# Altium project Power_driver.PrjPCB
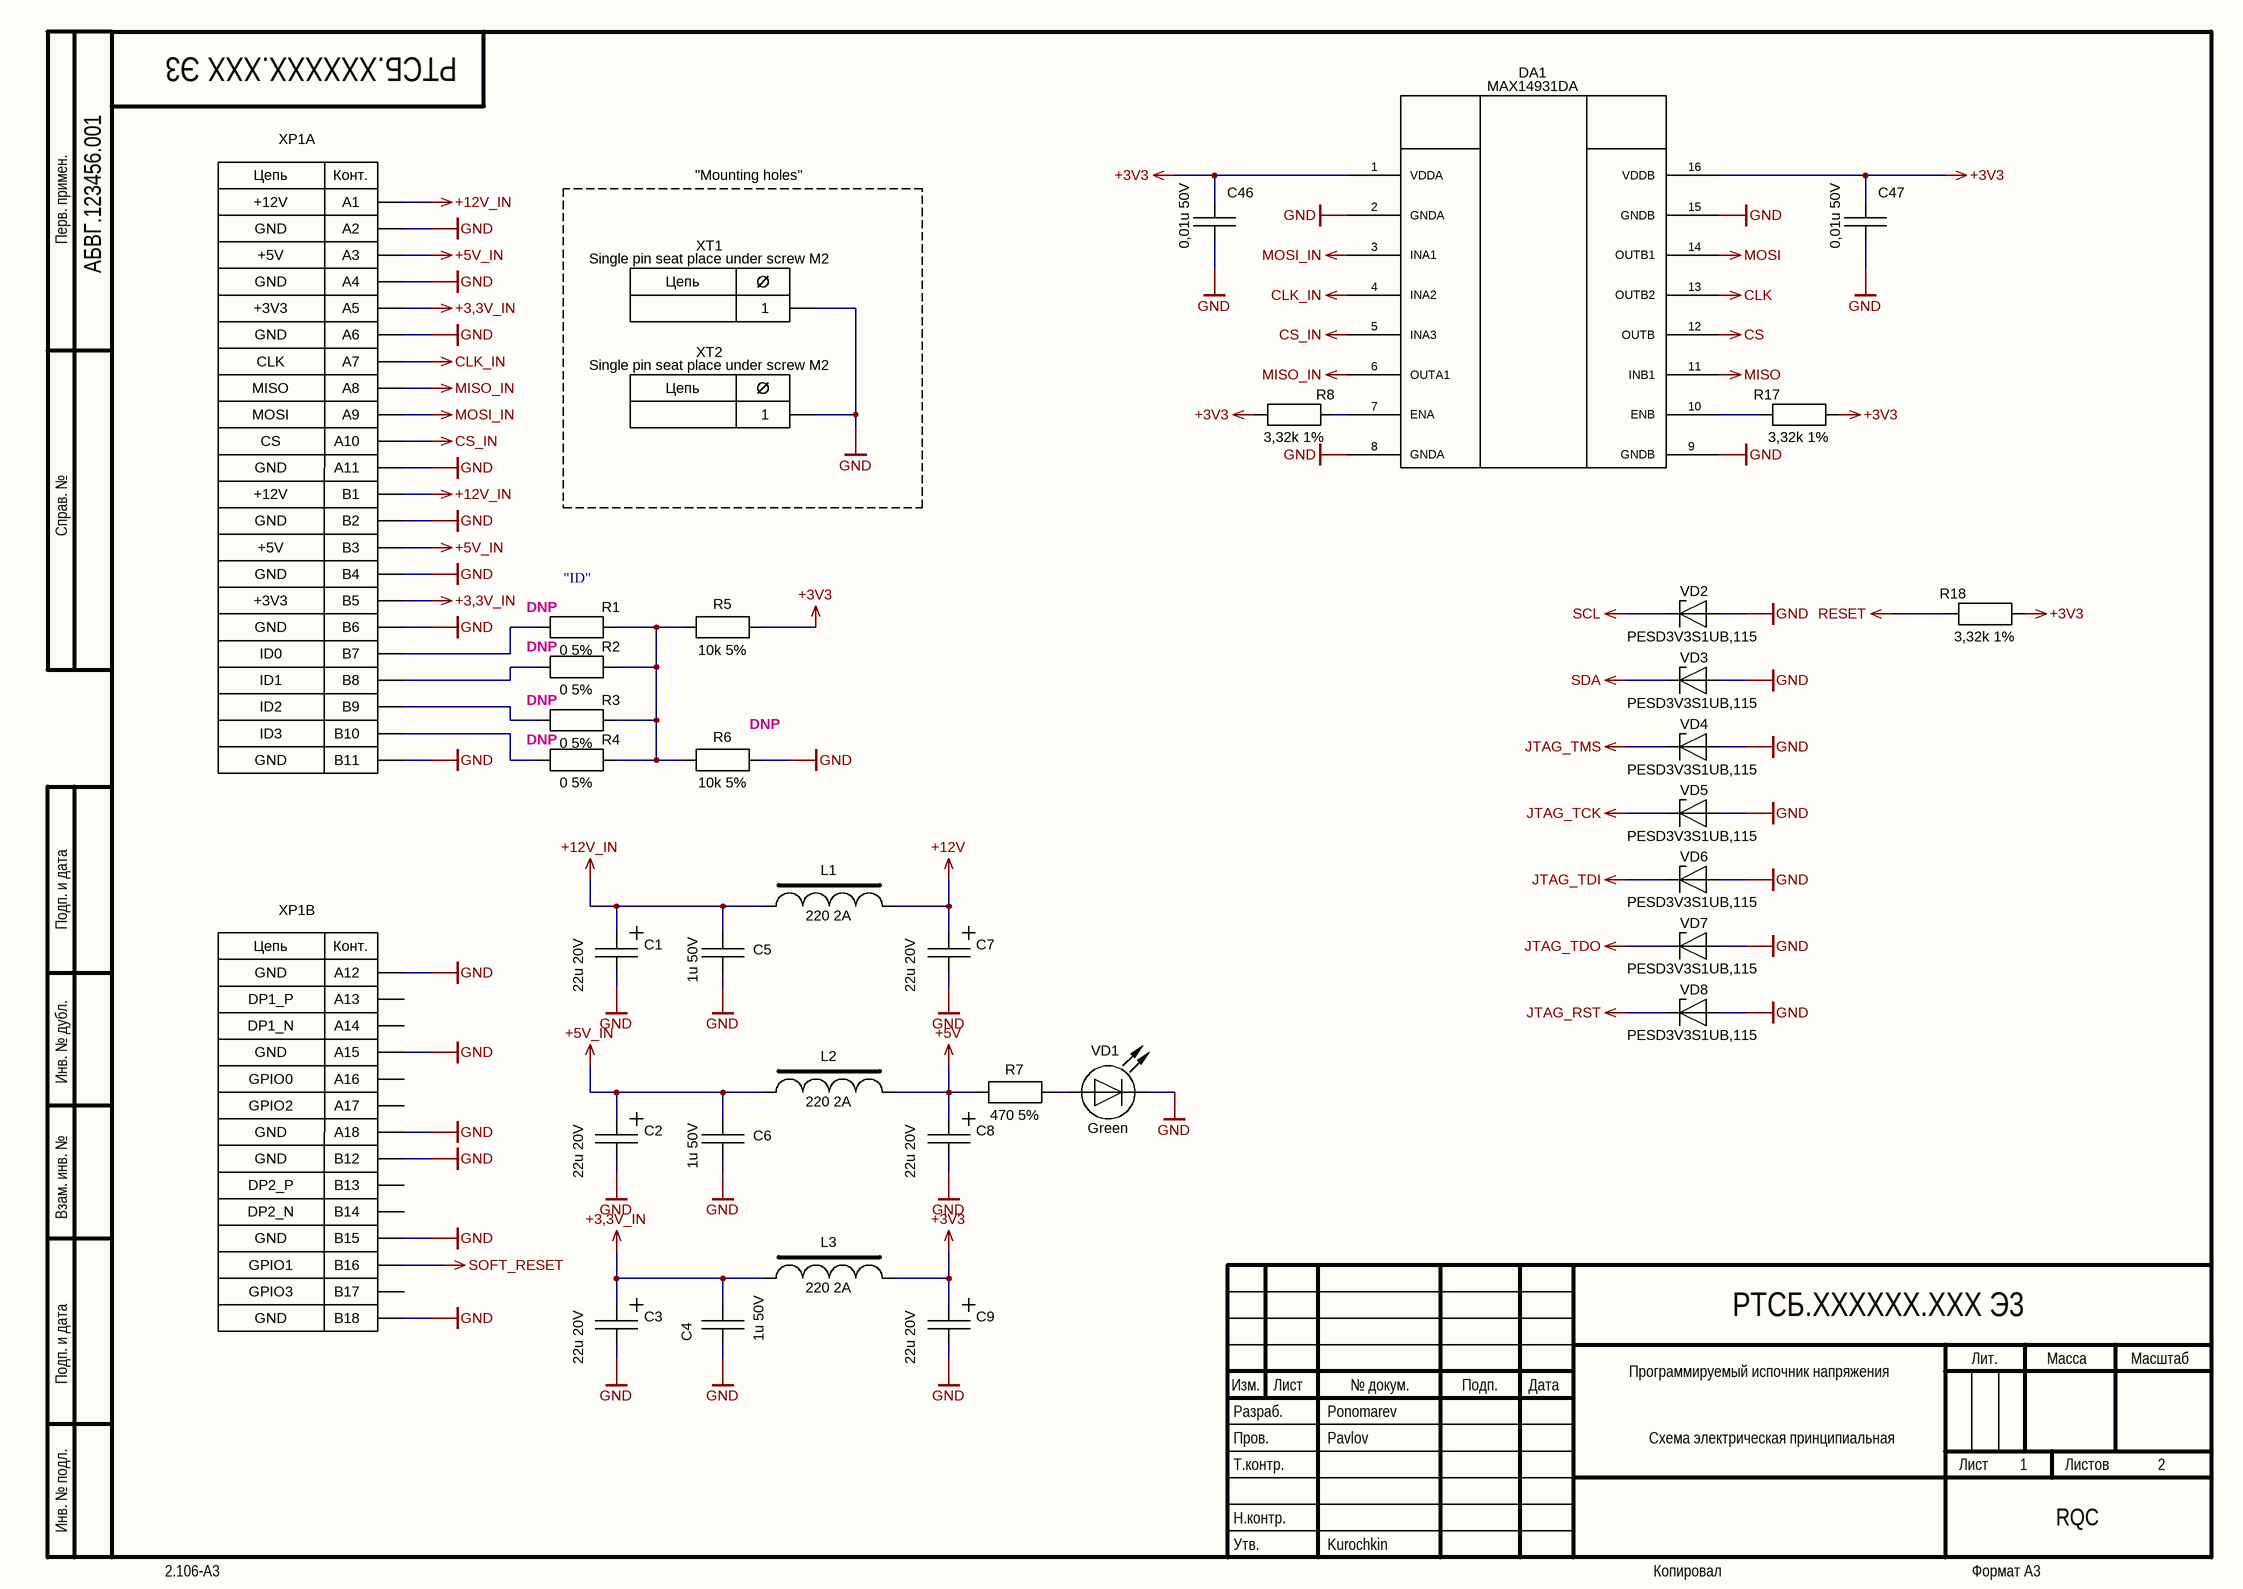
[diagram p0: Power_driver_power.SchDoc]
4 sheets, 105 parts. Net scope: global (net labels, ports and power ports of the same name join across sheets).
Board file: Power_driver_PCB.PcbDoc
Sheets:
  Power_driver_power.SchDoc
  Power_driver_AMP.SchDoc
  Power_driver_DAC_Connectors.SchDoc
  Power_driver_MCU.SchDoc

## Sheet Power_driver_power.SchDoc: Программируемый испочник напряжения
size 420 x 297 mm; ApprovedBy: Kurochkin; CheckedBy: Pavlov; Author: Ponomarev; CompanyName: RQC; DocumentNumber: РТСБ.XXXXXX.XXX Э3; SheetNumber: 1; SheetTotal: 2; DocumentType: Схема электрическая принципиальная; FirstReferrence: АБВГ.123456.001

### Parts
C1  22u 20V  [B_CAPMP3528X21N]
C2  22u 20V  [B_CAPMP3528X21N]
C3  22u 20V  [B_CAPMP3528X21N]
C4  1u 50V  [C0603_CAPC1608X09N]
C5  1u 50V  [C0603_CAPC1608X09N]
C6  1u 50V  [C0603_CAPC1608X09N]
C7  22u 20V  [B_CAPMP3528X21N]
C8  22u 20V  [B_CAPMP3528X21N]
C9  22u 20V  [B_CAPMP3528X21N]
C46  0,01u 50V  [C0603_CAPC1608X09N]
C47  0,01u 50V  [C0603_CAPC1608X09N]
DA1  MAX14931DA  [SOIC127P740X110-16N]
L1  220 2A  [I0805_INDC2012X11N]
L2  220 2A  [I0805_INDC2012X11N]
L3  220 2A  [I0805_INDC2012X11N]
R1  0 5%  Staff: DNP  [R0603_RESC1608X06N]
R2  0 5%  Staff: DNP  [R0603_RESC1608X06N]
R3  0 5%  Staff: DNP  [R0603_RESC1608X06N]
R4  0 5%  Staff: DNP  [R0603_RESC1608X06N]
R5  10k 5%  [R0603_RESC1608X06N]
R6  10k 5%  Staff: DNP  [R0603_RESC1608X06N]
R7  470 5%  [R0603_RESC1608X06N]
R8  3,32k 1%  [R0603_RESC1608X06N]
R17  3,32k 1%  [R0603_RESC1608X06N]
R18  3,32k 1%  [R0603_RESC1608X06N]
VD1  Green  [LED3010X012]
VD2  PESD3V3S1UB,115  [SOD523_SODFL160X65-2N]
VD3  PESD3V3S1UB,115  [SOD523_SODFL160X65-2N]
VD4  PESD3V3S1UB,115  [SOD523_SODFL160X65-2N]
VD5  PESD3V3S1UB,115  [SOD523_SODFL160X65-2N]
VD6  PESD3V3S1UB,115  [SOD523_SODFL160X65-2N]
VD7  PESD3V3S1UB,115  [SOD523_SODFL160X65-2N]
VD8  PESD3V3S1UB,115  [SOD523_SODFL160X65-2N]
XP1  (no value)  [PCI_EXP_36_EDGE_mod]  (parts A,B of 2)  (no BOM)
XT1  Single pin seat place under screw M2  [S_MOUNT_M2]
XT2  Single pin seat place under screw M2  [S_MOUNT_M2]

### Blocks framed on the sheet
"Mounting holes": XT1 XT2

### Nets
+3,3V_IN: C3.1 C4.2 L3.1 XP1.A5 XP1.B5
+3V3: C9.1 C46.1 C47.1 DA1.1(VDDA) DA1.16(VDDB) L3.2 R5.2 R8.1 R17.1 R18.1
+5V: C8.1 L2.2 R7.1
+5V_IN: C2.1 C6.2 L2.1 XP1.A3 XP1.B3
+12V: C7.1 L1.2
+12V_IN: C1.1 C5.2 L1.1 XP1.A1 XP1.B1
CLK: DA1.13(OUTB2)
CLK_IN: DA1.4(INA2) XP1.A7
CS: DA1.12(OUTB)
CS_IN: DA1.5(INA3) XP1.A10
GND: C1.2 C2.2 C3.2 C4.1 C5.1 C6.1 C7.2 C8.2 C9.2 C46.2 C47.2 DA1.2(GNDA) DA1.8(GNDA) DA1.9(GNDB) DA1.15(GNDB) R6.2 VD1.1(K) VD2.2(A) VD3.2(A) VD4.2(A) VD5.2(A) VD6.2(A) VD7.2(A) VD8.2(A) XP1.A2 XP1.A4 XP1.A6 XP1.A11 XP1.A12 XP1.A15 XP1.A18 XP1.B2 XP1.B4 XP1.B6 XP1.B11 XP1.B12 XP1.B15 XP1.B18 XT1.1 XT2.1
JTAG_RST: VD8.1(K)
JTAG_TCK: VD5.1(K)
JTAG_TDI: VD6.1(K)
JTAG_TDO: VD7.1(K)
JTAG_TMS: VD4.1(K)
MISO: DA1.11(INB1)
MISO_IN: DA1.6(OUTA1) XP1.A8
MOSI: DA1.14(OUTB1)
MOSI_IN: DA1.3(INA1) XP1.A9
RESET: R18.2
SCL: VD2.1(K)
SDA: VD3.1(K)
SOFT_RESET: XP1.B16
NetDA1_7: DA1.7(ENA) R8.2
NetDA1_10: DA1.10(ENB) R17.2
NetR1_1: R1.1 XP1.B7
NetR1_2: R1.2 R2.2 R3.2 R4.2 R5.1 R6.1
NetR2_1: R2.1 XP1.B8
NetR3_1: R3.1 XP1.B9
NetR4_1: R4.1 XP1.B10
NetR7_2: R7.2 VD1.2(A)

Not connected (* = marked no-connect by the designer): XP1 A13 A14 A16 A17 B13 B14 B17

### Notes on the sheet
- (near R1) "ID"
- Перв. примен.
- Справ. №
- Подп. и дата
- Инв. № дубл.
- Взам. инв. №
- Разраб.
- Изм.
- Лист
- № докум.
- Подп.
- Дата
- Лит.
- Масса
- Масштаб
- Пров.
- Т.контр.
- Листов
- Инв. № подл.
- Утв.
- Н.контр.
- 2.106-A3
- Копировал
- Формат А3
- (in symbol PCI_EXP_36_EDGE_mod, part A) Цепь; Конт.; +12V; GND; +5V; +3V3; CLK; MISO; MOSI; CS; ID0; ID1; ID2; ID3
- (in symbol PCI_EXP_36_EDGE_mod, part B) Цепь; Конт.; GND; DP1_P; DP1_N; GPIO0; GPIO2; DP2_P; DP2_N; GPIO1; GPIO3
- (in symbol S_MOUNT_M2) Цепь

### Library data of the parts
C1-C3 C7-C9 = 293D226X9020B2TE3: Solid Tantalum Capacitor, General purpose, Surface Mount; Manufacturer: Vishay; ValueBOM: 22мкФ ±10% 20В 2,1Ом Tantal B; ModelSTEP: Z:\LIB\ALTIUM\MODEL\STEP\Capacitor\B_CAPMP3528X21.Step; Designer: Dudarev; EOL: NO; PartNumber: 293D226X9020B2TE3; ValueSCH: 22u 20V; Mount: SMT; HelpURL: Z:\LIB\ALTIUM\INFO\Capacitor\Vishay293d-2.pdf; Modify: 28.06.2016
C4-C6 = CC0603KRX7R9BB105: Конденсатор керамический (MLCC) общего назначения 0603; Manufacturer: YAGEO; ValueBOM: 1мкФ ±10% 50В X7R 0603; ModelSTEP: Z:\LIB\ALTIUM\MODEL\STEP\Capacitor\C0603_CAPC1608X09.Step; Designer: Dudarev; EOL: NO; PartNumber: CC0603KRX7R9BB105; ValueSCH: 1u 50V; Mount: SMT; HelpURL: Z:\LIB\ALTIUM\INFO\Capacitor\UPY-GPHC_X7R_6.3V-to-50V_13.pdf; Modify: 28.06.2016
C46 C47 = CC0603KRX7R9BB103: Конденсатор керамический (MLCC) общего назначения 0603; Manufacturer: YAGEO; ValueBOM: 0,01мкФ ±10% 50В X7R 0603; ModelSTEP: Z:\LIB\ALTIUM\MODEL\STEP\Capacitor\C0603_CAPC1608X09.Step; Designer: Dudarev; EOL: NO; PartNumber: CC0603KRX7R9BB103; ValueSCH: 0,01u 50V; Mount: SMT; HelpURL: Z:\LIB\ALTIUM\INFO\Capacitor\UPY-GPHC_X7R_6.3V-to-50V_13.pdf; Modify: 28.06.2016
DA1 = MAX14931DA: 4-Channel, 1kVRMS, 2.75kVRMS, / and 3.75kVRMS Digital Isolators
L1-L3 = BLM21PG221SN1D: Chip Ferrite Bead 220 Ohm, 2A, 0805; Manufacturer: Murata Electronics; ModelSTEP: Z:\LIB\ALTIUM\MODEL\STEP\Inductor\I0805_INDC2012X11.Step; Designer: Pashinskiy; EOL: NO; PartNumber: BLM21PG221SN1D; ValueBOM: BLM21PG221SN1D; ValueSCH: 220 2A; Mount: SMT; HelpURL: Z:\LIB\ALTIUM\INFO\Inductor\Chip%20Ferrite%20Bead%20BLM21P%200805.pdf; Modify: 16.08.2016
R1-R4 = RC0603JR-070RL: Резистор толстопленочный общего назначения 0603; Manufacturer: YAGEO; ValueBOM: 0Ом 5% 75В 300ppm 0603; ModelSTEP: Z:\LIB\ALTIUM\MODEL\STEP\Resistor\R0603_RESC1005X04.step; Designer: Dudarev; EOL: NO; PartNumber: RC0603JR-070RL; ValueSCH: 0 5%; Mount: SMT; HelpURL: Z:\LIB\ALTIUM\INFO\Resistor\YAGEO\Lead free chip resistors RC_P.pdf; Modify: 28.06.2016
R5 R6 = RC0603JR-0710KL: Резистор толстопленочный общего назначения 0603; Manufacturer: YAGEO; ValueBOM: 10кОм 5% 75В 150ppm 0603; ModelSTEP: Z:\LIB\ALTIUM\MODEL\STEP\Resistor\R0603_RESC1005X04.step; Designer: Dudarev; EOL: NO; PartNumber: RC0603JR-0710KL; ValueSCH: 10k 5%; Mount: SMT; HelpURL: Z:\LIB\ALTIUM\INFO\Resistor\YAGEO\Lead free chip resistors RC_P.pdf; Modify: 28.06.2016
R7 = RC0603JR-07470RL: Резистор толстопленочный общего назначения 0603; Manufacturer: YAGEO; ValueBOM: 470Ом 5% 75В 150ppm 0603; ModelSTEP: Z:\LIB\ALTIUM\MODEL\STEP\Resistor\R0603_RESC1005X04.step; Designer: Dudarev; EOL: NO; PartNumber: RC0603JR-07470RL; ValueSCH: 470 5%; Mount: SMT; HelpURL: Z:\LIB\ALTIUM\INFO\Resistor\YAGEO\Lead free chip resistors RC_P.pdf; Modify: 28.06.2016
R8 R17 R18 = RC0603FR-073K32L: Резистор толстопленочный общего назначения 0603; Manufacturer: YAGEO; ValueBOM: 3,32кОм 1% 75В 150ppm 0603; ModelSTEP: Z:\LIB\ALTIUM\MODEL\STEP\Resistor\R0603_RESC1005X04.step; Designer: Dudarev; EOL: NO; PartNumber: RC0603FR-073K32L; ValueSCH: 3,32k 1%; Mount: SMT; HelpURL: Z:\LIB\ALTIUM\INFO\Resistor\YAGEO\Lead free chip resistors RC_P.pdf; Modify: 28.06.2016
VD1 = 155124VS73200: LED SMD Right Angle Bright Green 3mm x 1mm (1204); Manufacturer: Wurth Elektronik; ModelSTEP: Z:\LIB\ALTIUM\MODEL\STEP\LED\WL-SMSW_1204_round.step; Designer: Dudarev; EOL: NO; PartNumber: 155124VS73200; ValueBOM: 155124VS73200; ValueSCH: Green; Mount: SMT; HelpURL: Z:\LIB\ALTIUM\INFO\LED\155124VS73200.pdf; Modify: 08.06.2016
VD2-VD8 = PESD3V3S1UB,115: Transient Voltage Suppressor, 3.3V, Unidirectional,  SOD-523; Manufacturer: NXP; ModelSTEP: Z:\LIB\ALTIUM\MODEL\STEP\Suppressor\SOD523.Step; Designer: Pashinskiy; EOL: NO; PartNumber: PESD3V3S1UB,115; ValueBOM: PESD3V3S1UB,115; ValueSCH: PESD3V3S1UB,115; Mount: SMT; HelpURL: Z:\LIB\ALTIUM\INFO\Suppressor\PESDXS1UB_SERIES.pdf; Modify: 23.11.2016
XP1 = PCI_EXP_36_EDGE_mod: PCI Express connector 36 circuits
XT1 XT2 = S_MOUNT_M2: Manufacturer: RQC; ValueBOM: Отверстие под винт М2; Designer: Pashinskiy; EOL: NO; PartNumber: S_MOUNT_M2; ValueSCH: Single pin seat place under screw M2; Mount: -; Modify: 16.09.2016

## Sheet Power_driver_AMP.SchDoc
size 420 x 297 mm; Scale: 1:1; DocumentType: Схема электрическая принципиальная; FirstReferrence: АБВГ.123456.001
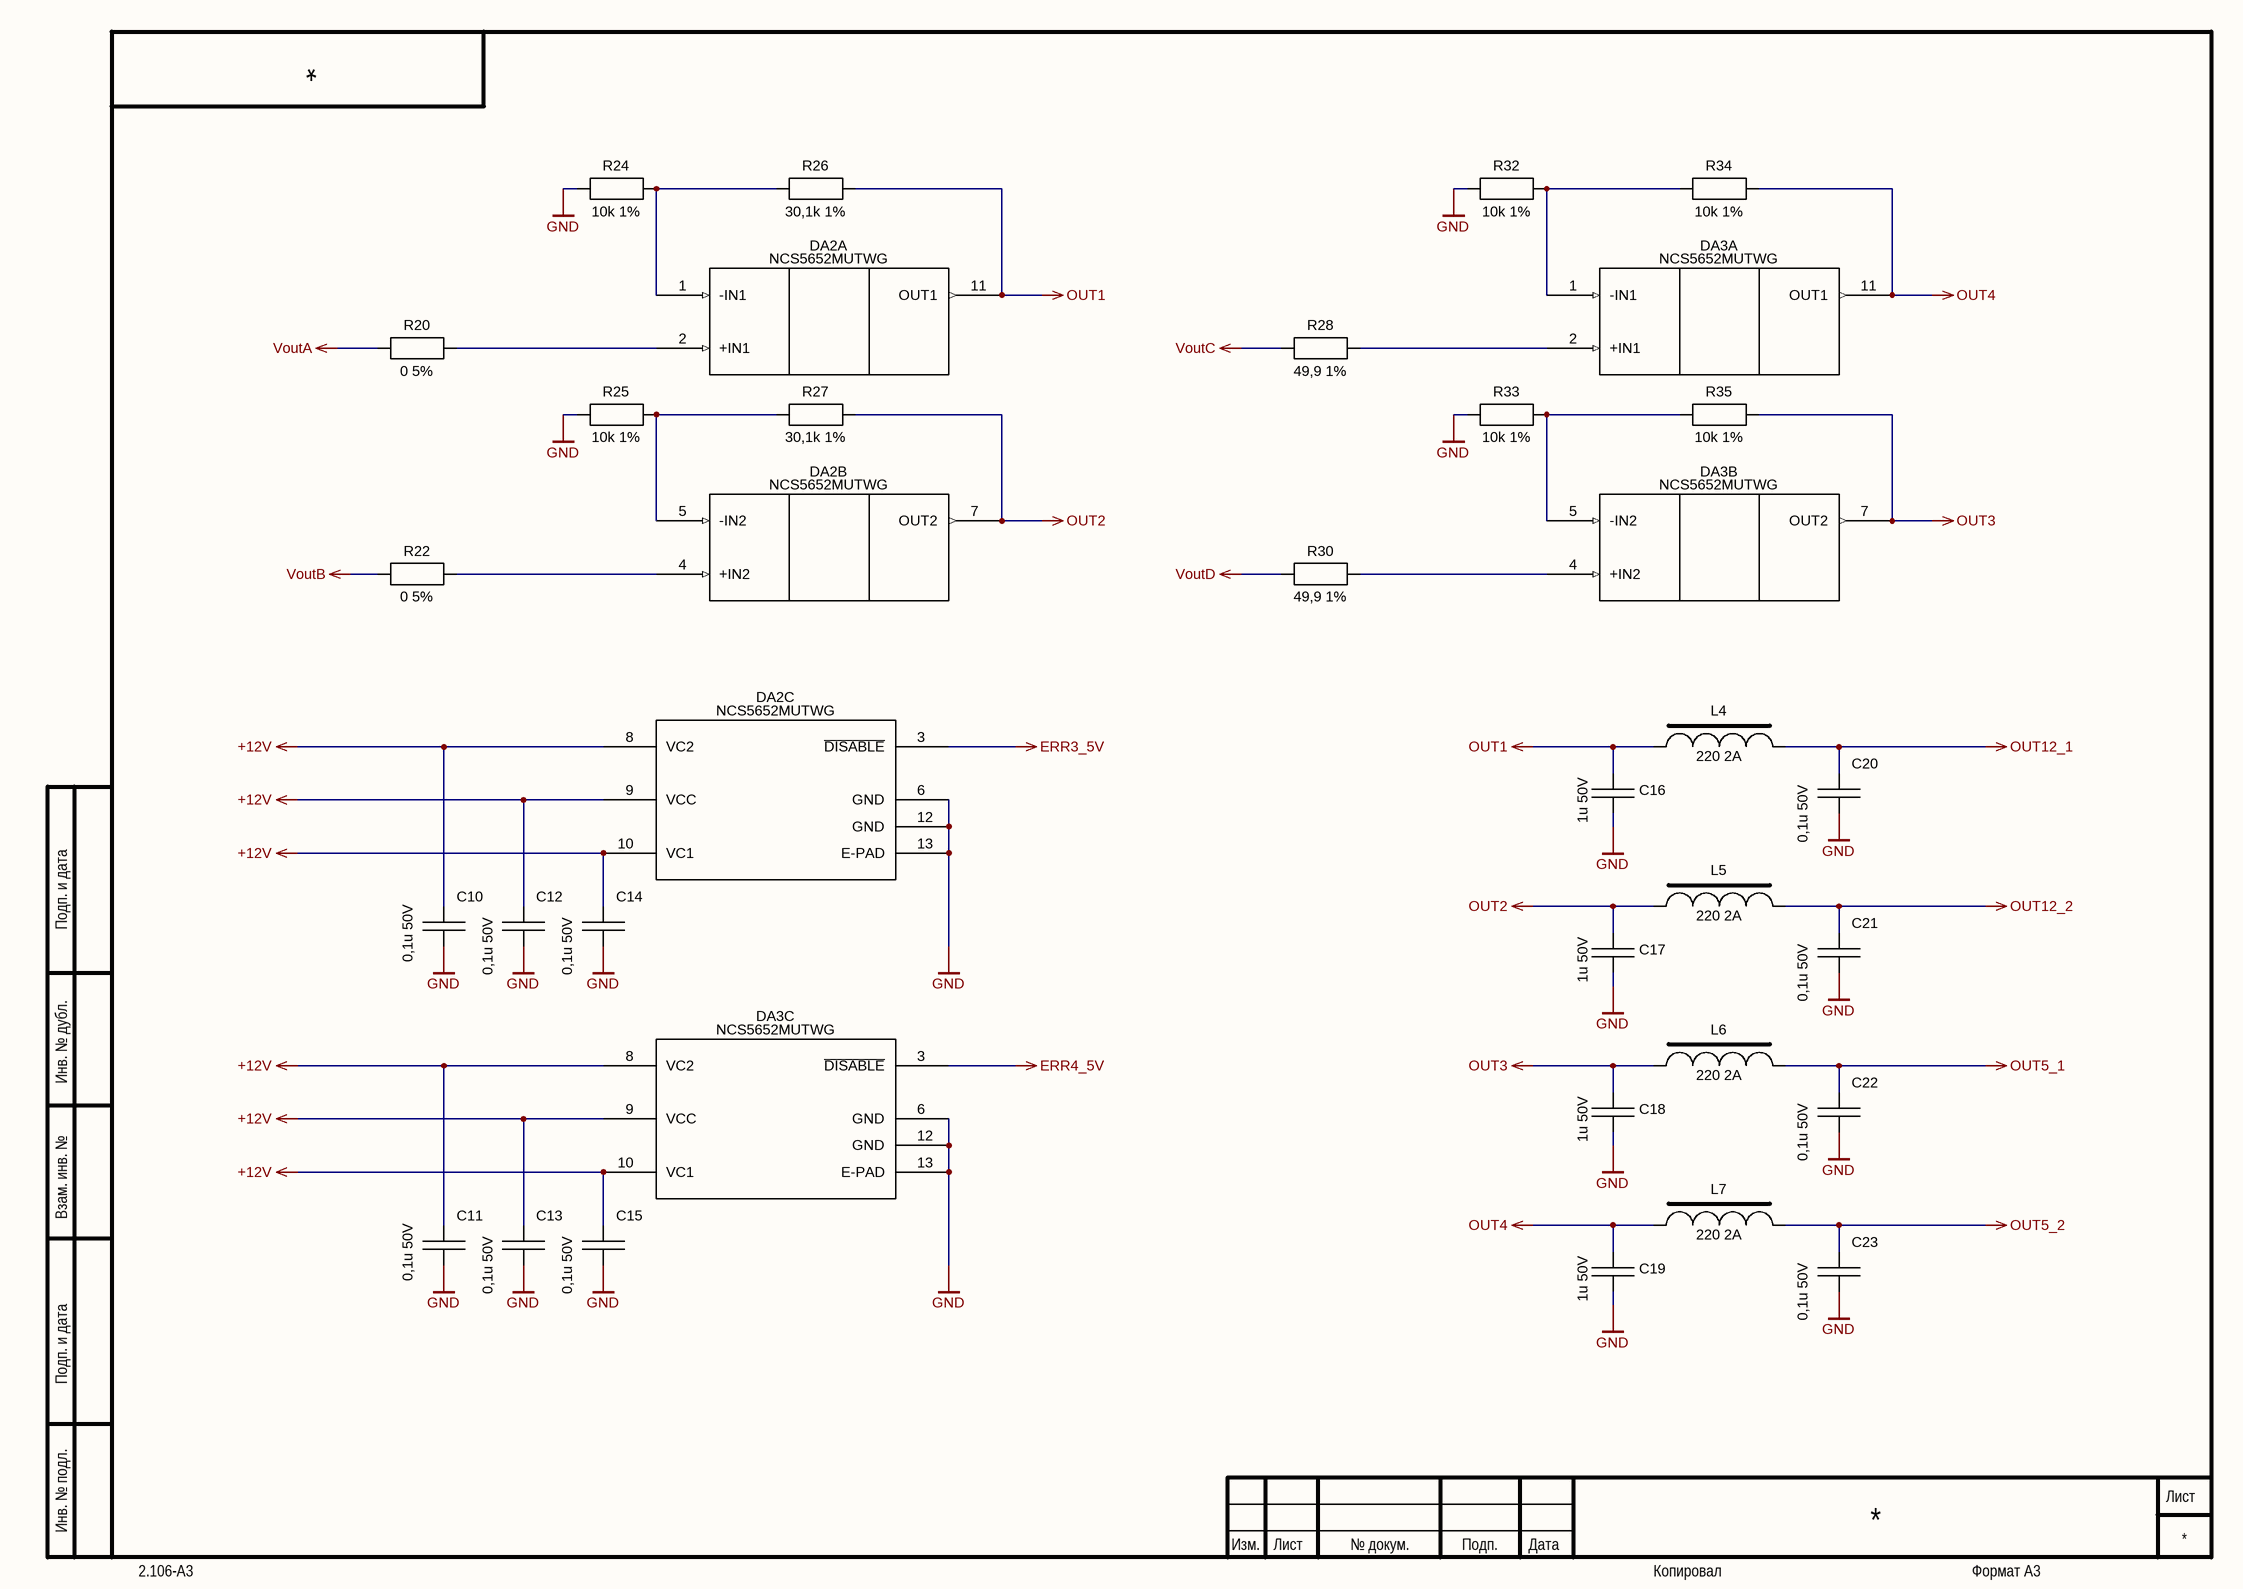
[diagram p1: Power_driver_AMP.SchDoc]

### Parts
C10  0,1u 50V  [C0603_CAPC1608X09N]
C11  0,1u 50V  [C0603_CAPC1608X09N]
C12  0,1u 50V  [C0603_CAPC1608X09N]
C13  0,1u 50V  [C0603_CAPC1608X09N]
C14  0,1u 50V  [C0603_CAPC1608X09N]
C15  0,1u 50V  [C0603_CAPC1608X09N]
C16  1u 50V  [C0603_CAPC1608X09N]
C17  1u 50V  [C0603_CAPC1608X09N]
C18  1u 50V  [C0603_CAPC1608X09N]
C19  1u 50V  [C0603_CAPC1608X09N]
C20  0,1u 50V  [C0603_CAPC1608X09N]
C21  0,1u 50V  [C0603_CAPC1608X09N]
C22  0,1u 50V  [C0603_CAPC1608X09N]
C23  0,1u 50V  [C0603_CAPC1608X09N]
DA2  NCS5652MUTWG  [UDFN12 3x3, 0.5P]  (parts A,B,C of 3)
DA3  NCS5652MUTWG  [UDFN12 3x3, 0.5P]  (parts A,B,C of 3)
L4  220 2A  [I0805_INDC2012X11N]
L5  220 2A  [I0805_INDC2012X11N]
L6  220 2A  [I0805_INDC2012X11N]
L7  220 2A  [I0805_INDC2012X11N]
R20  0 5%  [R0603_RESC1608X06N]
R22  0 5%  [R0603_RESC1608X06N]
R24  10k 1%  [R0603_RESC1608X06N]
R25  10k 1%  [R0603_RESC1608X06N]
R26  30,1k 1%  [R0603_RESC1608X06N]
R27  30,1k 1%  [R0603_RESC1608X06N]
R28  49,9 1%  [R0603_RESC1608X06N]
R30  49,9 1%  [R0603_RESC1608X06N]
R32  10k 1%  [R0603_RESC1608X06N]
R33  10k 1%  [R0603_RESC1608X06N]
R34  10k 1%  [R0603_RESC1608X06N]
R35  10k 1%  [R0603_RESC1608X06N]

### Nets
+12V: C10.1 C11.1 C12.1 C13.1 C14.1 C15.1 DA2.8(VC2) DA2.9(VCC) DA2.10(VC1) DA3.8(VC2) DA3.9(VCC) DA3.10(VC1)
ERR3_5V: DA2.3(~{DISABLE})
ERR4_5V: DA3.3(~{DISABLE})
GND: C10.2 C11.2 C12.2 C13.2 C14.2 C15.2 C16.1 C17.1 C18.1 C19.1 C20.2 C21.2 C22.2 C23.2 DA2.6(GND) DA2.12(GND) DA2.13(E-PAD) DA3.6(GND) DA3.12(GND) DA3.13(E-PAD) R24.1 R25.1 R32.1 R33.1
OUT1: C16.2 DA2.11(OUT1) L4.1 R26.2
OUT2: C17.2 DA2.7(OUT2) L5.1 R27.2
OUT3: C18.2 DA3.7(OUT2) L6.1 R35.2
OUT4: C19.2 DA3.11(OUT1) L7.1 R34.2
OUT5_1: C22.1 L6.2
OUT5_2: C23.1 L7.2
OUT12_1: C20.1 L4.2
OUT12_2: C21.1 L5.2
VoutA: R20.1
VoutB: R22.1
VoutC: R28.1
VoutD: R30.1
NetDA2_1: DA2.1(-IN1) R24.2 R26.1
NetDA2_2: DA2.2(+IN1) R20.2
NetDA2_4: DA2.4(+IN2) R22.2
NetDA2_5: DA2.5(-IN2) R25.2 R27.1
NetDA3_1: DA3.1(-IN1) R32.2 R34.1
NetDA3_2: DA3.2(+IN1) R28.2
NetDA3_4: DA3.4(+IN2) R30.2
NetDA3_5: DA3.5(-IN2) R33.2 R35.1

### Notes on the sheet
- Подп. и дата
- Инв. № дубл.
- Взам. инв. №
- Инв. № подл.
- Изм.
- Лист
- № докум.
- Подп.
- Дата
- 2.106-A3
- Копировал
- Формат А3

### Library data of the parts
C10-C15 C20-C23 = CC0603KRX7R9BB104: Конденсатор керамический (MLCC) общего назначения 0603; Manufacturer: YAGEO; ValueBOM: 0,1мкФ ±10% 50В X7R 0603; ModelSTEP: Z:\LIB\ALTIUM\MODEL\STEP\Capacitor\C0603_CAPC1608X09.Step; Designer: Dudarev; EOL: NO; PartNumber: CC0603KRX7R9BB104; ValueSCH: 0,1u 50V; Mount: SMT; HelpURL: Z:\LIB\ALTIUM\INFO\Capacitor\UPY-GPHC_X7R_6.3V-to-50V_13.pdf; Modify: 28.06.2016
C16-C19 = CC0603KRX7R9BB105: as C4 on sheet Power_driver_power; PartNumber: CC0603KRX7R9BB105; ValueSCH: 1u 50V; Mount: SMT; HelpURL: Z:\LIB\ALTIUM\INFO\Capacitor\UPY-GPHC_X7R_6.3V-to-50V_13.pdf; Modify: 28.06.2016
DA2 DA3 = NCS5652MUTWG: High Speed, High Output Current, Dual Operational Amplifier, SMT
L4-L7 = BLM21PG221SN1D: as L1 on sheet Power_driver_power; PartNumber: BLM21PG221SN1D; ValueBOM: BLM21PG221SN1D; ValueSCH: 220 2A; Mount: SMT; HelpURL: Z:\LIB\ALTIUM\INFO\Inductor\Chip%20Ferrite%20Bead%20BLM21P%200805.pdf; Modify: 16.08.2016
R20 R22 = RC0603JR-070RL: as R1 on sheet Power_driver_power; PartNumber: RC0603JR-070RL; ValueSCH: 0 5%; Mount: SMT; HelpURL: Z:\LIB\ALTIUM\INFO\Resistor\YAGEO\Lead free chip resistors RC_P.pdf; Modify: 28.06.2016
R24 R25 R32-R35 = RC0603FR-0710KL: Резистор толстопленочный общего назначения 0603; Manufacturer: YAGEO; ValueBOM: 10кОм 1% 75В 150ppm 0603; ModelSTEP: Z:\LIB\ALTIUM\MODEL\STEP\Resistor\R0603_RESC1005X04.step; Designer: Dudarev; EOL: NO; PartNumber: RC0603FR-0710KL; ValueSCH: 10k 1%; Mount: SMT; HelpURL: Z:\LIB\ALTIUM\INFO\Resistor\YAGEO\Lead free chip resistors RC_P.pdf; Modify: 28.06.2016
R26 R27 = RC0603FR-0730K1L: Резистор толстопленочный общего назначения 0603; Manufacturer: YAGEO; ValueBOM: 30,1кОм 1% 75В 150ppm 0603; ModelSTEP: Z:\LIB\ALTIUM\MODEL\STEP\Resistor\R0603_RESC1005X04.step; Designer: Dudarev; EOL: NO; PartNumber: RC0603FR-0730K1L; ValueSCH: 30,1k 1%; Mount: SMT; HelpURL: Z:\LIB\ALTIUM\INFO\Resistor\YAGEO\Lead free chip resistors RC_P.pdf; Modify: 28.06.2016
R28 R30 = RC0603FR-0749R9L: Резистор толстопленочный общего назначения 0603; Manufacturer: YAGEO; ValueBOM: 49,9Ом 1% 75В 200ppm 0603; ModelSTEP: Z:\LIB\ALTIUM\MODEL\STEP\Resistor\R0603_RESC1005X04.step; Designer: Dudarev; EOL: NO; PartNumber: RC0603FR-0749R9L; ValueSCH: 49,9 1%; Mount: SMT; HelpURL: Z:\LIB\ALTIUM\INFO\Resistor\YAGEO\Lead free chip resistors RC_P.pdf; Modify: 28.06.2016

## Sheet Power_driver_DAC_Connectors.SchDoc
size 420 x 297 mm; Scale: 1:1; DocumentType: Схема электрическая принципиальная; FirstReferrence: АБВГ.123456.001
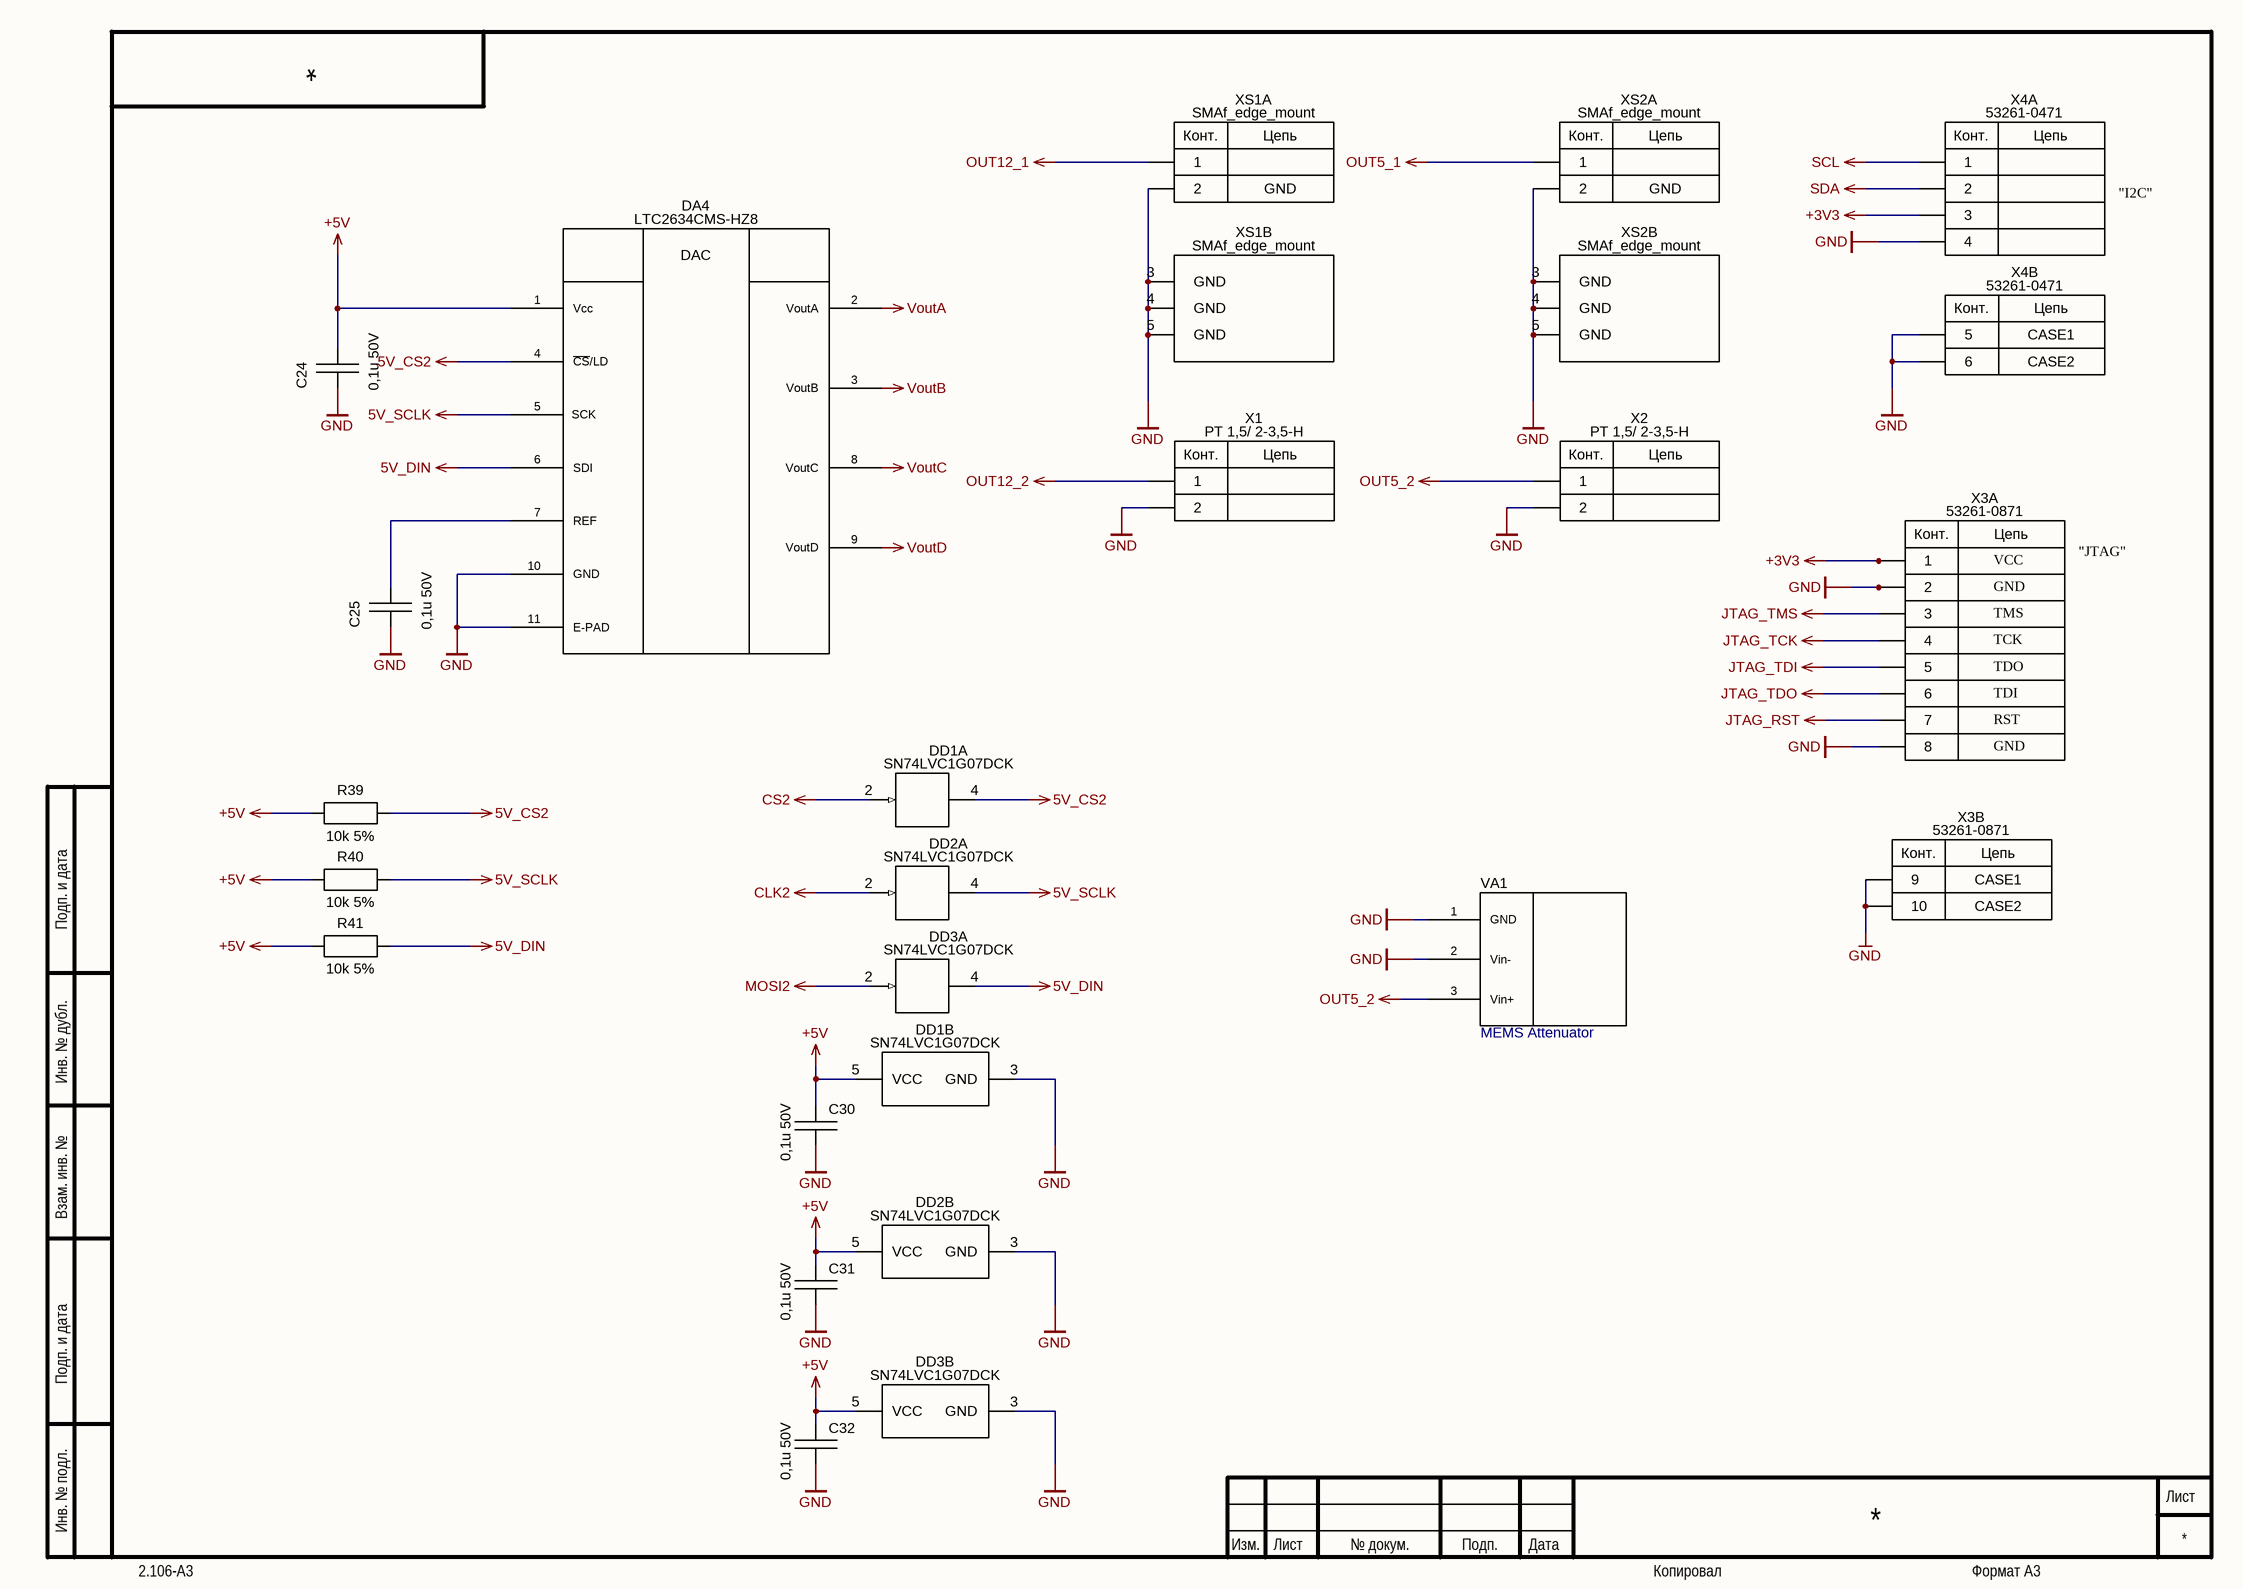
[diagram p2: Power_driver_DAC_Connectors.SchDoc]

### Parts
C24  0,1u 50V  [C0603_CAPC1608X09N]
C25  0,1u 50V  [C0603_CAPC1608X09N]
C30  0,1u 50V  [C0603_CAPC1608X09N]
C31  0,1u 50V  [C0603_CAPC1608X09N]
C32  0,1u 50V  [C0603_CAPC1608X09N]
DA4  LTC2634CMS-HZ8  [MSOP50P500X110_HS-11N]
DD1  SN74LVC1G07DCK  [SC70_SOT65P210X110-5N]  (parts A,B of 2)
DD2  SN74LVC1G07DCK  [SC70_SOT65P210X110-5N]  (parts A,B of 2)
DD3  SN74LVC1G07DCK  [SC70_SOT65P210X110-5N]  (parts A,B of 2)
R39  10k 5%  [R0603_RESC1608X06N]
R40  10k 5%  [R0603_RESC1608X06N]
R41  10k 5%  [R0603_RESC1608X06N]
VA1  MEMS Attenuator  [Attenuator]
X1  PT 1,5/ 2-3,5-H  [PT 1,5/ 2-3,5-H]
X2  PT 1,5/ 2-3,5-H  [PT 1,5/ 2-3,5-H]
X3  53261-0871  [53261-0871]  (parts A,B of 2)
X4  53261-0471  [53261-0471]  (parts A,B of 2)
XS1  SMAf_edge_mount  [142-0701-851]  (parts A,B of 2)
XS2  SMAf_edge_mount  [142-0701-851]  (parts A,B of 2)

### Nets
5V_CS2: DA4.4(~{CS}/LD) DD1.4(Y) R39.2
5V_DIN: DA4.6(SDI) DD3.4(Y) R41.2
5V_SCLK: DA4.5(SCK) DD2.4(Y) R40.2
+3V3: X3.1 X4.3
+5V: C24.2 C30.1 C31.1 C32.1 DA4.1(Vcc) DD1.5(VCC) DD2.5(VCC) DD3.5(VCC) R39.1 R40.1 R41.1
CLK2: DD2.2(A)
CS2: DD1.2(A)
GND: C24.1 C25.1 C30.2 C31.2 C32.2 DA4.10(GND) DA4.11(E-PAD) DD1.3(GND) DD2.3(GND) DD3.3(GND) VA1.1(GND) VA1.2(Vin-) X1.2 X2.2 X3.2 X3.8 X3.9 X3.10 X4.4 X4.5 X4.6 XS1.2 XS1.3(GND) XS1.4(GND) XS1.5(GND) XS2.2 XS2.3(GND) XS2.4(GND) XS2.5(GND)
JTAG_RST: X3.7
JTAG_TCK: X3.4
JTAG_TDI: X3.5
JTAG_TDO: X3.6
JTAG_TMS: X3.3
MOSI2: DD3.2(A)
OUT5_1: XS2.1
OUT5_2: VA1.3(Vin+) X2.1
OUT12_1: XS1.1
OUT12_2: X1.1
SCL: X4.1
SDA: X4.2
VoutA: DA4.2(VoutA)
VoutB: DA4.3(VoutB)
VoutC: DA4.8(VoutC)
VoutD: DA4.9(VoutD)
NetC25_2: C25.2 DA4.7(REF)

### Notes on the sheet
- "I2C"
- VCC
- GND
- "JTAG"
- TMS
- TCK
- TDO
- TDI
- RST
- Подп. и дата
- Инв. № дубл.
- Взам. инв. №
- Инв. № подл.
- Изм.
- Лист
- № докум.
- Подп.
- Дата
- 2.106-A3
- Копировал
- Формат А3
- (in symbol 142-0701-851, part A) Конт.; Цепь
- (in symbol 53261-0471, part A) Конт.; Цепь
- (in symbol 53261-0471, part B) Конт.; Цепь; CASE1; CASE2
- (in symbol 53261-0871, part A) Конт.; Цепь
- (in symbol 53261-0871, part B) Конт.; Цепь; CASE1; CASE2
- (in symbol LTC2634CMS-HZ8) DAC
- (in symbol PT 1,5/ 2-3,5-H) Конт.; Цепь

### Library data of the parts
C24 C25 C30-C32 = CC0603KRX7R9BB104: as C10 on sheet Power_driver_AMP; PartNumber: CC0603KRX7R9BB104; ValueSCH: 0,1u 50V; Mount: SMT; HelpURL: Z:\LIB\ALTIUM\INFO\Capacitor\UPY-GPHC_X7R_6.3V-to-50V_13.pdf; Modify: 28.06.2016
DA4 = LTC2634CMS-HZ8: SPI  Vout quad DAC with internal reference. MSOP 10
DD1-DD3 = SN74LVC1G07DCK: Single buffer\driver with open-drain outputs for 1.65 - 5.5V VCC operation SC70; Manufacturer: TI; ModelSTEP: Z:\LIB\ALTIUM\MODEL\STEP\IC_SO\SC70_SOT65P210X110-5.Step; Designer: Dudarev; EOL: NO; PartNumber: SN74LVC1G07DCK; ValueBOM: SN74LVC1G07DCK; ValueSCH: SN74LVC1G07DCK; Mount: SMT; HelpURL: Z:\LIB\ALTIUM\INFO\IC_Logic\sn74lvc1g07.pdf; Modify: 28.06.2016
R39-R41 = RC0603JR-0710KL: as R5 on sheet Power_driver_power; PartNumber: RC0603JR-0710KL; ValueSCH: 10k 5%; Mount: SMT; HelpURL: Z:\LIB\ALTIUM\INFO\Resistor\YAGEO\Lead free chip resistors RC_P.pdf; Modify: 28.06.2016
X1 X2 = PT 1,5/ 2-3,5-H: PT 1,5/ 2-3,5-H Terminal Block Connector. Strait
X3 = 53261-0871: PicoBlade Header, 1,25mm Pitch, 1 Row, 8 Circuits, Right Angle, SMT; Manufacturer: Molex; ModelSTEP: Z:\LIB\ALTIUM\MODEL\STEP\Connector_PIN\532610871.step; Designer: Martynov; EOL: NO; PartNumber: 53261-0871; ValueBOM: 53261-0871; ValueSCH: 53261-0871; Mount: SMT; HelpURL: Z:\LIB\ALTIUM\INFO\Connector_PIN\53261-0xxx.pdf; Modify: 10.04.2017
X4 = 53261-0471: PicoBlade Header, 1,25mm Pitch, 1 Row, 4 Circuits, Right Angle, SMT; Manufacturer: Molex; ModelSTEP: Z:\LIB\ALTIUM\MODEL\STEP\Connector_PIN\532610471.step; Designer: Martynov; EOL: NO; PartNumber: 53261-0471; ValueBOM: 53261-0471; ValueSCH: 53261-0471; Mount: SMT; HelpURL: Z:\LIB\ALTIUM\INFO\Connector_PIN\53261-0xxx.pdf; Modify: 10.04.2017
XS1 XS2 = 142-0701-851: RF COAXIAL CONNECTOR 50 Ohms, 18GHz, SMA FEMALE,  PCB 1,5mm edge mounted, SMT; Manufacturer: Johnson; ModelSTEP: Z:\LIB\ALTIUM\MODEL\STEP\Connector_Misc\dr-3d-CSS-JOHN-142-0701-851.stp; Designer: Pashinskiy; EOL: NO; PartNumber: 142-0701-851; ValueBOM: 142-0701-851; ValueSCH: SMAf_edge_mount; Mount: SMT; HelpURL: Z:\LIB\ALTIUM\INFO\Connector_Misc\dr-1420701851.pdf; Modify: 09.02.2017

## Sheet Power_driver_MCU.SchDoc
size 420 x 297 mm; Scale: 1:1; DocumentType: Схема электрическая принципиальная; FirstReferrence: АБВГ.123456.001
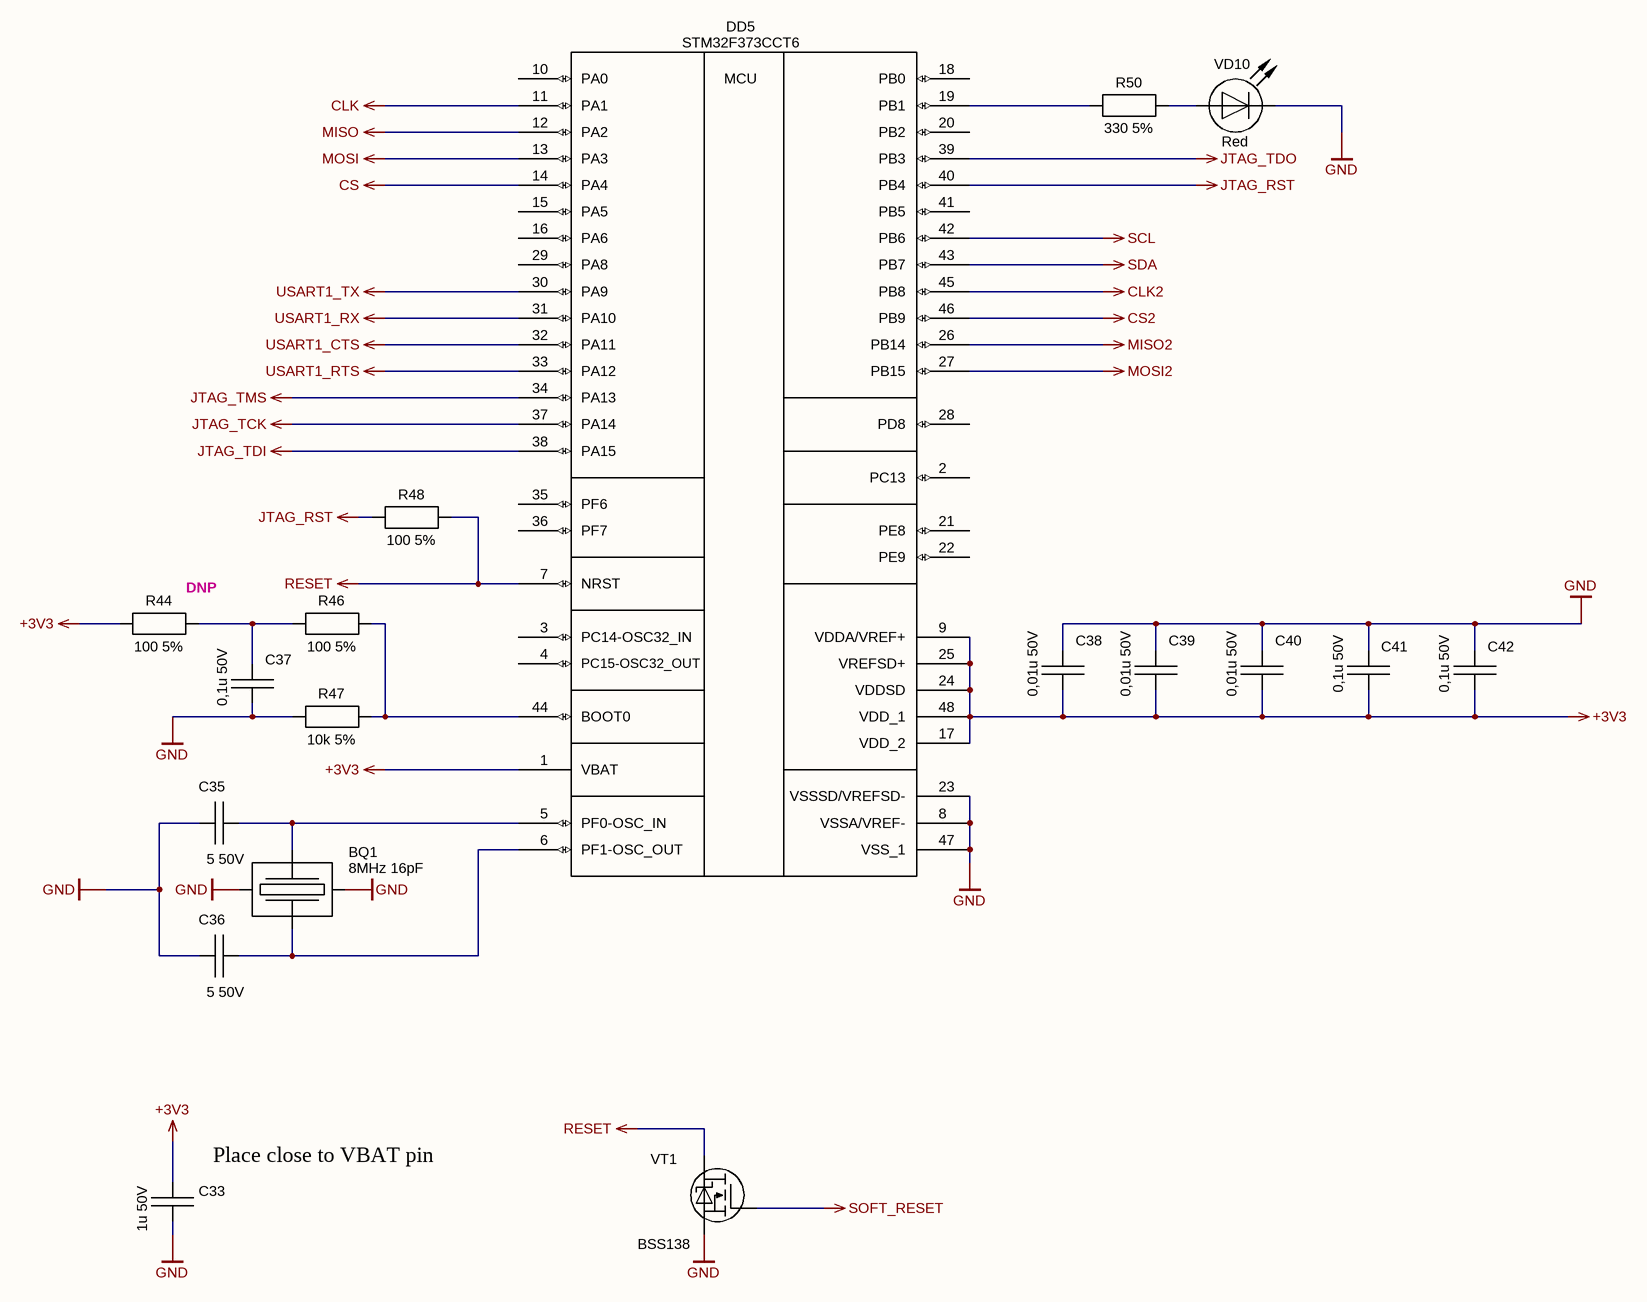
[diagram p3: Power_driver_MCU.SchDoc]

### Parts
BQ1  8MHz 16pF  [Crystal_50x32x110]
C33  1u 50V  [C0603_CAPC1608X09N]
C35  5 50V  [C0603_CAPC1608X09N]
C36  5 50V  [C0603_CAPC1608X09N]
C37  0,1u 50V  [C0603_CAPC1608X09N]
C38  0,01u 50V  [C0603_CAPC1608X09N]
C39  0,01u 50V  [C0603_CAPC1608X09N]
C40  0,01u 50V  [C0603_CAPC1608X09N]
C41  0,1u 50V  [C0603_CAPC1608X09N]
C42  0,1u 50V  [C0603_CAPC1608X09N]
DD5  STM32F373CCT6  [LQFP48_TSQFP50P900X900X160-48L]
R44  100 5%  Staff: DNP  [R0603_RESC1608X06N]
R46  100 5%  [R0603_RESC1608X06N]
R47  10k 5%  [R0603_RESC1608X06N]
R48  100 5%  [R0603_RESC1608X06N]
R50  330 5%  [R0603_RESC1608X06N]
VD10  Red  [LED_0603]
VT1  BSS138  [SOT23_SOT95P237X110-3M]

### Nets
+3V3: C33.2 C38.2 C39.2 C40.2 C41.2 C42.2 DD5.1(VBAT) DD5.9(VDDA/VREF+) DD5.17(VDD_2) DD5.24(VDDSD) DD5.25(VREFSD+) DD5.48(VDD_1) R44.1
CLK: DD5.11(PA1)
CLK2: DD5.45(PB8)
CS: DD5.14(PA4)
CS2: DD5.46(PB9)
GND: BQ1.2 BQ1.4 C33.1 C35.1 C36.1 C37.2 C38.1 C39.1 C40.1 C41.1 C42.1 DD5.8(VSSA/VREF-) DD5.23(VSSSD/VREFSD-) DD5.47(VSS_1) R47.1 VD10.1(K) VT1.2(S)
JTAG_RST: DD5.40(PB4) R48.1
JTAG_TCK: DD5.37(PA14)
JTAG_TDI: DD5.38(PA15)
JTAG_TDO: DD5.39(PB3)
JTAG_TMS: DD5.34(PA13)
MISO: DD5.12(PA2)
MISO2: DD5.26(PB14)
MOSI: DD5.13(PA3)
MOSI2: DD5.27(PB15)
RESET: DD5.7(NRST) R48.2 VT1.3(D)
SCL: DD5.42(PB6)
SDA: DD5.43(PB7)
SOFT_RESET: VT1.1(G)
USART1_CTS: DD5.32(PA11)
USART1_RTS: DD5.33(PA12)
USART1_RX: DD5.31(PA10)
USART1_TX: DD5.30(PA9)
NetBQ1_1: BQ1.1 C36.2 DD5.6(PF1-OSC_OUT)
NetBQ1_3: BQ1.3 C35.2 DD5.5(PF0-OSC_IN)
NetC37_1: C37.1 R44.2 R46.1
NetDD5_19: DD5.19(PB1) R50.1
NetDD5_44: DD5.44(BOOT0) R46.2 R47.2
NetR50_2: R50.2 VD10.2(A)

Not connected (* = marked no-connect by the designer): DD5 2(PC13) 3(PC14-OSC32_IN) 4(PC15-OSC32_OUT) 10(PA0) 15(PA5) 16(PA6) 18(PB0) 20(PB2) 21(PE8) 22(PE9) 28(PD8) 29(PA8) 35(PF6) 36(PF7) 41(PB5)

### Notes on the sheet
- (near C33) Place close to VBAT pin
- Подп. и дата
- Инв. № дубл.
- Взам. инв. №
- Инв. № подл.
- Изм.
- Лист
- № докум.
- Подп.
- Дата
- 2.106-A3
- Копировал
- Формат А3
- (in symbol STM32F373CCT6) MCU

### Library data of the parts
BQ1 = KX-9A 8.0 MHz: Резонатор кварцевый 8 МГц, 50 ppm, 16 пФ, 5,0 x 3,2mm, SMT; Manufacturer: Geyer; ModelSTEP: Z:\LIB\ALTIUM\MODEL\STEP\Crystal\Crystal_smd_52x34x1.step; Designer: Pashinskiy; EOL: NO; PartNumber: KX-9A 8.0 MHz; ValueBOM: KX-9A 8.0 MHz; ValueSCH: 8MHz 16pF; Mount: SMT; HelpURL: Z:\LIB\ALTIUM\INFO\Crystal\GEYER-KX-9A_Series.pdf; Modify: 24.11.2016
C33 = CC0603KRX7R9BB105: as C4 on sheet Power_driver_power; PartNumber: CC0603KRX7R9BB105; ValueSCH: 1u 50V; Mount: SMT; HelpURL: Z:\LIB\ALTIUM\INFO\Capacitor\UPY-GPHC_X7R_6.3V-to-50V_13.pdf; Modify: 28.06.2016
C35 C36 = CC0603CRNPO9BN5R0: Конденсатор керамический (MLCC) общего назначения 0603; Manufacturer: YAGEO; ValueBOM: 5пФ ±0,25пФ 50В NP0 0603; ModelSTEP: Z:\LIB\ALTIUM\MODEL\STEP\Capacitor\C0603_CAPC1608X09.Step; Designer: Pashinskiy; EOL: NO; PartNumber: CC0603CRNPO9BN5R0; ValueSCH: 5 50V; Mount: SMT; HelpURL: Z:\LIB\ALTIUM\INFO\Capacitor\UPY-GP_NP0_16V-to-50V_14.pdf; Modify: 19.08.2016
C37 C41 C42 = CC0603KRX7R9BB104: as C10 on sheet Power_driver_AMP; PartNumber: CC0603KRX7R9BB104; ValueSCH: 0,1u 50V; Mount: SMT; HelpURL: Z:\LIB\ALTIUM\INFO\Capacitor\UPY-GPHC_X7R_6.3V-to-50V_13.pdf; Modify: 28.06.2016
C38-C40 = CC0603KRX7R9BB103: as C46 on sheet Power_driver_power; PartNumber: CC0603KRX7R9BB103; ValueSCH: 0,01u 50V; Mount: SMT; HelpURL: Z:\LIB\ALTIUM\INFO\Capacitor\UPY-GPHC_X7R_6.3V-to-50V_13.pdf; Modify: 28.06.2016
DD5 = STM32F373CCT6: Microcontroller ARM Cortex-M4, 32b, MCU+FPU, 1,25DMIPS, 256 kB Flash, 32kB SRAM, USB, LQFP48
R44 R46 R48 = RC0603JR-07100RL: Резистор толстопленочный общего назначения 0603; Manufacturer: YAGEO; ValueBOM: 100Ом 5% 75В 200ppm 0603; ModelSTEP: Z:\LIB\ALTIUM\MODEL\STEP\Resistor\R0603_RESC1005X04.step; Designer: Dudarev; EOL: NO; PartNumber: RC0603JR-07100RL; ValueSCH: 100 5%; Mount: SMT; HelpURL: Z:\LIB\ALTIUM\INFO\Resistor\YAGEO\Lead free chip resistors RC_P.pdf; Modify: 28.06.2016
R47 = RC0603JR-0710KL: as R5 on sheet Power_driver_power; PartNumber: RC0603JR-0710KL; ValueSCH: 10k 5%; Mount: SMT; HelpURL: Z:\LIB\ALTIUM\INFO\Resistor\YAGEO\Lead free chip resistors RC_P.pdf; Modify: 28.06.2016
R50 = RC0603JR-07330RL: Резистор толстопленочный общего назначения 0603; Manufacturer: YAGEO; ValueBOM: 330Ом 5% 75В 150ppm 0603; ModelSTEP: Z:\LIB\ALTIUM\MODEL\STEP\Resistor\R0603_RESC1005X04.step; Designer: Dudarev; EOL: NO; PartNumber: RC0603JR-07330RL; ValueSCH: 330 5%; Mount: SMT; HelpURL: Z:\LIB\ALTIUM\INFO\Resistor\YAGEO\Lead free chip resistors RC_P.pdf; Modify: 28.06.2016
VD10 = VLMS1300-GS08: LED SMD Super Red 1,6mm x 0,8mm; Manufacturer: Vishay Semiconductors; ModelSTEP: Z:\LIB\ALTIUM\MODEL\STEP\LED\User Library-LED_0603_R.STEP; Designer: Losev; EOL: NO; PartNumber: VLMS1300-GS08; ValueBOM: VLMS1300-GS08; ValueSCH: Red; Mount: SMT; HelpURL: Z:\LIB\ALTIUM\INFO\LED\vlmo1300-241412.pdf; Modify: 11.11.2016
VT1 = N-MOSFET: N-Channel MOSFET transistor Logic level

## Nets that join several sheets
+3V3: Power_driver_power (10 pins), Power_driver_DAC_Connectors (X3.1 X4.3), Power_driver_MCU (13 pins)
+5V: Power_driver_power (C8.1 L2.2 R7.1), Power_driver_DAC_Connectors (11 pins)
+12V: Power_driver_power (C7.1 L1.2), Power_driver_AMP (12 pins)
CLK: Power_driver_power (DA1.13), Power_driver_MCU (DD5.11)
CLK2: Power_driver_DAC_Connectors (DD2.2), Power_driver_MCU (DD5.45)
CS: Power_driver_power (DA1.12), Power_driver_MCU (DD5.14)
CS2: Power_driver_DAC_Connectors (DD1.2), Power_driver_MCU (DD5.46)
GND: Power_driver_power (40 pins), Power_driver_AMP (24 pins), Power_driver_DAC_Connectors (29 pins), Power_driver_MCU (17 pins)
JTAG_RST: Power_driver_power (VD8.1), Power_driver_DAC_Connectors (X3.7), Power_driver_MCU (DD5.40 R48.1)
JTAG_TCK: Power_driver_power (VD5.1), Power_driver_DAC_Connectors (X3.4), Power_driver_MCU (DD5.37)
JTAG_TDI: Power_driver_power (VD6.1), Power_driver_DAC_Connectors (X3.5), Power_driver_MCU (DD5.38)
JTAG_TDO: Power_driver_power (VD7.1), Power_driver_DAC_Connectors (X3.6), Power_driver_MCU (DD5.39)
JTAG_TMS: Power_driver_power (VD4.1), Power_driver_DAC_Connectors (X3.3), Power_driver_MCU (DD5.34)
MISO: Power_driver_power (DA1.11), Power_driver_MCU (DD5.12)
MOSI: Power_driver_power (DA1.14), Power_driver_MCU (DD5.13)
MOSI2: Power_driver_DAC_Connectors (DD3.2), Power_driver_MCU (DD5.27)
OUT5_1: Power_driver_AMP (C22.1 L6.2), Power_driver_DAC_Connectors (XS2.1)
OUT5_2: Power_driver_AMP (C23.1 L7.2), Power_driver_DAC_Connectors (VA1.3 X2.1)
OUT12_1: Power_driver_AMP (C20.1 L4.2), Power_driver_DAC_Connectors (XS1.1)
OUT12_2: Power_driver_AMP (C21.1 L5.2), Power_driver_DAC_Connectors (X1.1)
RESET: Power_driver_power (R18.2), Power_driver_MCU (DD5.7 R48.2 VT1.3)
SCL: Power_driver_power (VD2.1), Power_driver_DAC_Connectors (X4.1), Power_driver_MCU (DD5.42)
SDA: Power_driver_power (VD3.1), Power_driver_DAC_Connectors (X4.2), Power_driver_MCU (DD5.43)
SOFT_RESET: Power_driver_power (XP1.B16), Power_driver_MCU (VT1.1)
VoutA: Power_driver_AMP (R20.1), Power_driver_DAC_Connectors (DA4.2)
VoutB: Power_driver_AMP (R22.1), Power_driver_DAC_Connectors (DA4.3)
VoutC: Power_driver_AMP (R28.1), Power_driver_DAC_Connectors (DA4.8)
VoutD: Power_driver_AMP (R30.1), Power_driver_DAC_Connectors (DA4.9)